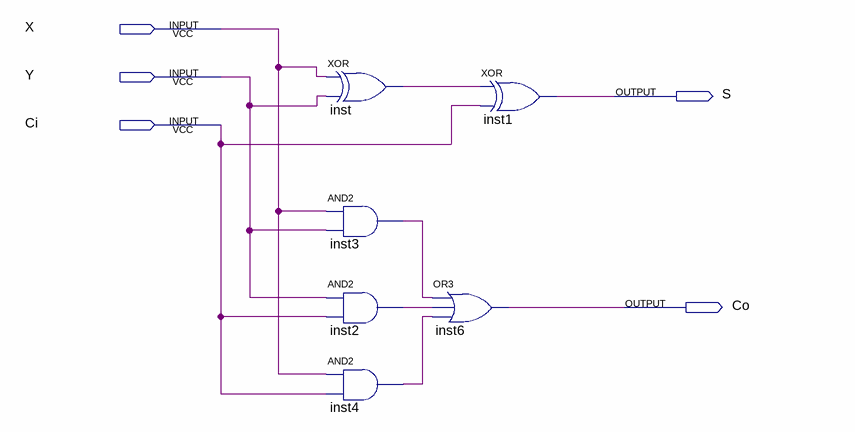
[diagram p0: schematic sheet]
// Quartus schematic FULLADDER.bdf as structural Verilog: 6 symbols, 5 pins
module FULLADDER (
  input  X,
  input  Y,
  input  Ci,
  output S,
  output Co
);

  wire inst2_out, inst3_out, inst4_out, inst_out;

  xor inst (inst_out, X, Y);
  and inst3 (inst3_out, X, Y);
  and inst2 (inst2_out, Y, Ci);
  and inst4 (inst4_out, X, Ci);
  xor inst1 (S, inst_out, Ci);
  or inst6 (Co, inst3_out, inst2_out, inst4_out);
endmodule
